# Altium project RoomClimateClock.PrjPcb
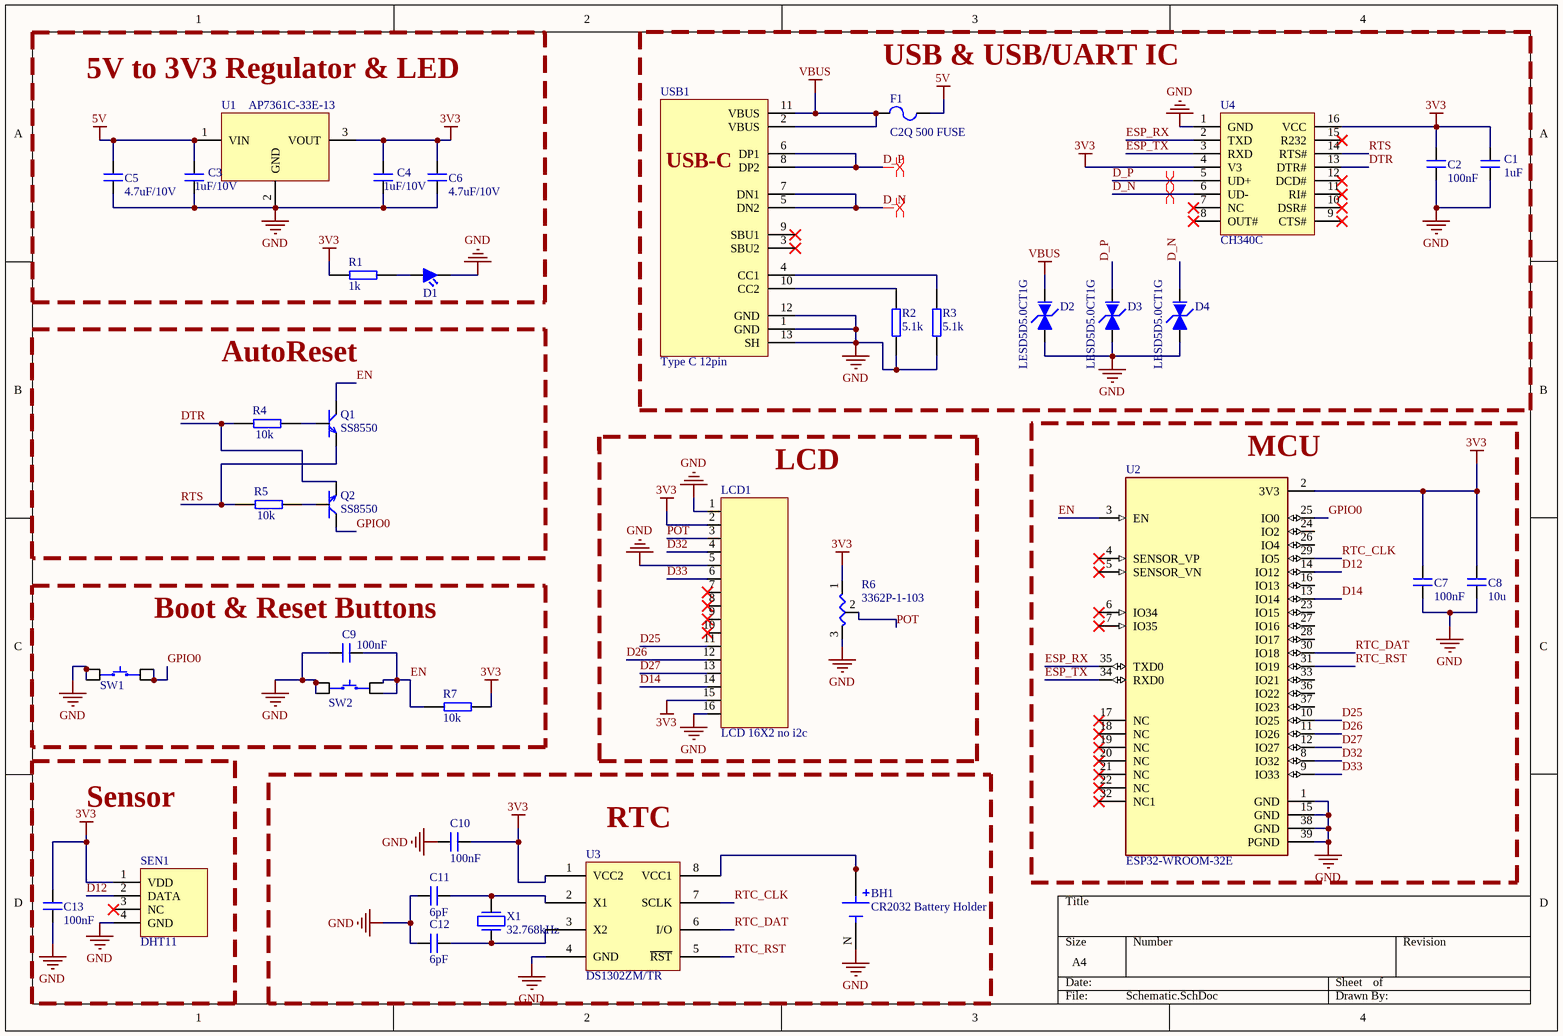
[diagram p0: Schematic.SchDoc]
1 sheet, 38 parts. Net scope: global (net labels, ports and power ports of the same name join across sheets).
Board file: PCB1.PcbDoc

## Sheet Schematic.SchDoc
size A4; SheetNumber: 1; SheetTotal: 1

### Parts
BH1  CR2032 Battery Holder  [3035 battery holder CR2032]
C1  1uF  [0603 CAP]
C2  100nF  [0402 CAP]
C3  1uF/10V  [0603 CAP]
C4  1uF/10V  [0603 CAP]
C5  4.7uF/10V  [0402 CAP]
C6  4.7uF/10V  [0402 CAP]
C7  100nF  [0402 CAP]
C8  10u  [0805 CAP]
C9  100nF  [0402 CAP]
C10  100nF  [0402 CAP]
C11  6pF  [0402 CAP]
C12  6pF  [0402 CAP]
C13  100nF  [0402 CAP]
D1  LED RED 0805  [LED 0805]  (value not drawn)
D2  LESD5D5.0CT1G  [SC-79/SOD-523]
D3  LESD5D5.0CT1G  [SC-79/SOD-523]
D4  LESD5D5.0CT1G  [SC-79/SOD-523]
F1  C2Q 500 FUSE  [C2Q 500 0603]
LCD1  LCD 16X2 no i2c  [LCD 16X2 NO I2C]
Q1  SS8550  [SOT23]
Q2  SS8550  [SOT23]
R1  1k  [0402 RES]
R2  5.1k  [0402 RES]
R3  5.1k  [0402 RES]
R4  10k  [0402 RES]
R5  10k  [0402 RES]
R6  3362P-1-103  [3362P-1-103]
R7  10k  [0402 RES]
SEN1  DHT11  [DHT11]
SW1  SWITCH TACTILE  [4 pin tactile switch]  (value not drawn)
SW2  SWITCH TACTILE  [4 pin tactile switch]  (value not drawn)
U1  AP7361C-33E-13  [SOT223]
U2  ESP32-WROOM-32E  [ESP32-WROOM-32E]
U3  DS1302ZM/TR  [SOP-8]
U4  CH340C  [SOP-16]
USB1  Type C 12pin  [TYPE-C 16PIN 2MD(073)]
X1  32.768kHz  [SMD3215-2P]

### Blocks framed on the sheet
5V to 3V3 Regulator & LED: C3-C6 D1 R1 U1
USB & USB/UART IC: C1 C2 D2-D4 F1 R2 R3 U4 USB1
AutoReset: Q1 Q2 R4 R5
MCU: C7 C8 U2
Boot & Reset Buttons: C9 R7 SW1 SW2
Sensor: C13 SEN1
RTC: BH1 C10-C12 U3 X1

### Nets
3V3: C1.2 C2.2 C4.2 C6.2 C7.2 C8.2 C10.2 C13.2 LCD1.2 LCD1.15 R1.1 R6.1 R7.1 SEN1.1(VDD) U1.3(VOUT) U2.2(3V3) U3.1(VCC2) U4.4(V3) U4.16(VCC)
5V: C3.2 C5.2 F1.2 U1.1(VIN)
GND: BH1.N(NEG) C1.1 C2.1 C3.1 C4.1 C5.1 C6.1 C7.1 C8.1 C9.1 C10.1 C11.2 C12.2 C13.1 D1.1 D2.2 D3.2 D4.2 LCD1.1 LCD1.5 LCD1.16 R2.1 R3.1 R6.3 SEN1.4(GND) SW1.1 SW1.3 SW2.1 SW2.3 U1.2(GND) U2.1(GND) U2.15(GND) U2.38(GND) U2.39(PGND) U3.4(GND) U4.1(GND) USB1.1(GND) USB1.12(GND) USB1.13(SH)
VBUS: D2.1 F1.1 USB1.2(VBUS) USB1.11(VBUS)
D12: SEN1.2(DATA) U2.14(IO12)
D14: LCD1.14 U2.13(IO14)
D25: LCD1.11 U2.10(IO25)
D26: LCD1.12 U2.11(IO26)
D27: LCD1.13 U2.12(IO27)
D32: LCD1.4 U2.8(IO32)
D33: LCD1.6 U2.9(IO33)
D_N: D4.1 U4.6(UD-) USB1.5(DN2) USB1.7(DN1)
D_P: D3.1 U4.5(UD+) USB1.6(DP1) USB1.8(DP2)
DTR: Q2.2(E) R4.1 U4.13(DTR#)
EN: C9.2 Q1.3(C) R7.2 SW2.2 SW2.4 U2.3(EN)
ESP_RX: U2.35(TXD0) U4.2(TXD)
ESP_TX: U2.34(RXD0) U4.3(RXD)
GPIO0: Q2.3(C) SW1.2 SW1.4 U2.25(IO0)
POT: LCD1.3 R6.2
RTC_CLK: U2.29(IO5) U3.7(SCLK)
RTC_DAT: U2.30(IO18) U3.6(I/O)
RTC_RST: U2.31(IO19) U3.5(~{RST})
RTS: Q1.2(E) R5.1 U4.14(RTS#)
NetBH1_P: BH1.P(POS) U3.8(VCC1)
NetC11_1: C11.1 U3.2(X1) X1.2
NetC12_1: C12.1 U3.3(X2) X1.1
NetD1_2: D1.2 R1.2
NetQ1_1: Q1.1(B) R4.2
NetQ2_1: Q2.1(B) R5.2
NetR2_2: R2.2 USB1.10(CC2)
NetR3_2: R3.2 USB1.4(CC1)

Not connected (* = marked no-connect by the designer): LCD1 7* 8* 9* 10*; SEN1 3(NC)*; U2 4(SENSOR_VP)* 5(SENSOR_VN)* 6(IO34)* 7(IO35)* 16(IO13) 17(NC)* 18(NC)* 19(NC)* 20(NC)* 21(NC)* 22(NC)* 23(IO15) 24(IO2) 26(IO4) 27(IO16) 28(IO17) 32(NC1)* 33(IO21) 36(IO22) 37(IO23); U4 7(NC)* 8(OUT#)* 9(CTS#)* 10(DSR#)* 11(RI#)* 12(DCD#)* 15(R232)*; USB1 3(SBU2)* 9(SBU1)*

### Layout directives
differential pair: D_N, D_P

### Notes on the sheet
- LCD
- (in symbol USB TYPE C 12 PIN (Right Angle)) USB-C

### Library data of the parts
BH1 = CR2032 Battery Holder: Holder Battery; Coin Battery; 1 Cell; PC Pin; 0.787 in. Dia.; Manufacturer: Keystone Electronics; Manufacturer Part Number: 3035; Supplier: Digikey; Supplier Part Number: 36-3035-ND; RoHS: Yes; Category: Batteries and Accessories; Stock: 76867; Pricing: 1=0,32, 25=0,2912, 100=0,2209, 250=0,19516, 500=0,1522, 1000=0,13912 (USD); ComponentLink1URL: http://www.keyelco.com/product-pdf.cfm?p=14185&src-supplier=Digikey; ComponentLink1Description: http://www.keyelco.com/product-pdf.cfm?p=14185&src-supplier=Digikey; ComponentLink2URL: https://datasheet.octopart.com/3035-Keystone-datasheet-137320232.pdf?src-supplier=TME; ComponentLink2Description: https://datasheet.octopart.com/3035-Keystone-datasheet-137320232.pdf?src-supplier=TME
C1 = 0603 1u CAP: Ceramic Capacitor, Multilayer, Ceramic, 25V, 10% +Tol, 10% -Tol, X7R, 15% TC, 1uF, Surface Mount, 0603; Manufacturer: Murata; Manufacturer Part Number: GCM188R71E105KA64D; Multilayer: Yes; Reference Standard: AEC-Q200; Case: 0603; Supplier: Digikey; Supplier Part Number: 490-10673-6-ND; RoHS: Yes; Category: Ceramic Capacitors; Stock: 2612025; Pricing: 1=0,24, 10=0,158, 50=0,1, 100=0,08, 500=0,05776, 1000=0,0511 (USD); Mounting Technology: Surface Mount; Pins: 2; Dielectric Material: Ceramic; Package Shape: Rectangular; Case/Package: 0603; Terminal Finish: Nickel; Min Operating Temperature: -55°C; Max Operating Temperature: 125°C; JESD-609 Code: e3; Value: 1uF; Capacitor Type: Ceramic; Tolerance  (fill in as +-): 10%; Package Style: SMTMeter; Packaging: Tape and Reel; Tolerance (fill in as +-): 10%; Rated DC Voltage (URdc): 25V; Temperature Characteristics Code: X7R; Termination: Wraparound; Length: 1.6mm; Width: 0.8mm; Height: 0.9mm; Reach SVHC Compliant: Yes; RoHS Compliant: Yes; ComponentLink1URL: https://datasheet.ciiva.com:443/pdfs/VipMasterIC/IC/MURE/MURE-S-A0004362469/MURE-S-A0004362812-1.pdf?src-supplier=IHS+Markit; ComponentLink1Description: https://datasheet.ciiva.com:443/pdfs/VipMasterIC/IC/MURE/MURE-S-A0004362469/MURE-S-A0004362812-1.pdf?src-supplier=IHS+Markit; ComponentLink2URL: https://datasheet.ciiva.com/11616/product-11616499.pdf?src-supplier=Avnet; ComponentLink2Description: https://datasheet.ciiva.com/11616/product-11616499.pdf?src-supplier=Avnet; ComponentLink3URL: https://datasheet.ciiva.com/26843/getdatasheetpartid-562446-26843671.pdf?src-supplier=Verical; ComponentLink3Description: https://datasheet.ciiva.com/26843/getdatasheetpartid-562446-26843671.pdf?src-supplier=Verical
C2 C7 C9 C10 C13 = 0402 100n AP: Ceramic Capacitor, Multilayer, Ceramic, 25V, 10% +Tol, 10% -Tol, X7R, 15% TC, 0.1uF, Surface Mount, 0402; Manufacturer: Murata; Manufacturer Part Number: GRM155R71E104KE14J; Multilayer: Yes; Case: 0402; Supplier: Digikey; Supplier Part Number: 490-14603-1-ND; RoHS: Yes; Category: Ceramic Capacitors; Stock: 3911559; Pricing: 1=0,1, 10=0,024, 50=0,0136, 100=0,0105, 500=0,00794, 1000=0,00623, 2500=0,00566, 5000=0,00521 (USD); Mounting Technology: Surface Mount; Pins: 2; Dielectric Material: Ceramic; Package Shape: Rectangular; Case/Package: 0402; Terminal Finish: Nickel; Min Operating Temperature: -55°C; Max Operating Temperature: 125°C; JESD-609 Code: e3; Value: 100nF; Capacitor Type: Ceramic; Tolerance  (fill in as +-): 10%; Package Style: SMTMeter; Packaging: Tape and Reel; Tolerance (fill in as +-): 10%; Rated DC Voltage (URdc): 25V; Temperature Characteristics Code: X7R; Termination: Wraparound; Length: 1mm; Width: 0.5mm; Height: 0.5mm; Reach SVHC Compliant: Yes; RoHS Compliant: Yes; ComponentLink1URL: https://datasheet.ciiva.com:443/pdfs/VipMasterIC/IC/MURE/MURE-S-A0004362469/MURE-S-A0004364872-1.pdf?src-supplier=IHS+Markit; ComponentLink1Description: https://datasheet.ciiva.com:443/pdfs/VipMasterIC/IC/MURE/MURE-S-A0004362469/MURE-S-A0004364872-1.pdf?src-supplier=IHS+Markit; ComponentLink2URL: http://www.mouser.com/ds/2/281/c02e-2905.pdf?src-supplier=Mouser; ComponentLink2Description: http://www.mouser.com/ds/2/281/c02e-2905.pdf?src-supplier=Mouser; ComponentLink3URL: https://datasheet.octopart.com/GRM155R71E104KE14J-Murata-datasheet-155345056.pdf?src-supplier=Element14; ComponentLink3Description: https://datasheet.octopart.com/GRM155R71E104KE14J-Murata-datasheet-155345056.pdf?src-supplier=Element14; ComponentLink4URL: http://search.murata.co.jp/Ceramy/image/img/A01X/G101/ENG/GRM155R71E104KE14-01.pdf?src-supplier=Digikey; ComponentLink4Description: http://search.murata.co.jp/Ceramy/image/img/A01X/G101/ENG/GRM155R71E104KE14-01.pdf?src-supplier=Digikey; ComponentLink5URL: https://datasheet.octopart.com/GRM155R71E104KE14J-Murata-datasheet-165579666.pdf?src-supplier=TME; ComponentLink5Description: https://datasheet.octopart.com/GRM155R71E104KE14J-Murata-datasheet-165579666.pdf?src-supplier=TME
C3 C4 = 0603 1u CAP: MURATA GRM155R61A475MEAAD; Manufacturer Part Number: GCM188R71E105KA64D; Dielectric Material: Ceramic; Value: 1uF; Multilayer: Yes; Tolerance  (fill in as +-): 10%; Rated DC Voltage (URdc): 25V; Temperature Characteristics Code: X7R; Reference Standard: AEC-Q200; Case: 0603; Supplier: Digikey; Supplier Part Number: 490-10673-6-ND; Manufacturer: Murata; RoHS: Yes; Category: Ceramic Capacitors; Stock: 2612025; Pricing: 1=0,24, 10=0,158, 50=0,1, 100=0,08, 500=0,05776, 1000=0,0511 (USD); Mounting Technology: Surface Mount; Pins: 2; Package Shape: Rectangular; Case/Package: 0603; Terminal Finish: Nickel; Min Operating Temperature: -55°C; Max Operating Temperature: 125°C; JESD-609 Code: e3; Capacitor Type: Ceramic; Package Style: SMTMeter; Packaging: Tape and Reel; Tolerance (fill in as +-): 10%; Termination: Wraparound; Length: 1.6mm; Width: 0.8mm; Height: 0.9mm; Reach SVHC Compliant: Yes; RoHS Compliant: Yes; ComponentLink1URL: https://datasheet.ciiva.com:443/pdfs/VipMasterIC/IC/MURE/MURE-S-A0004362469/MURE-S-A0004362812-1.pdf?src-supplier=IHS+Markit; ComponentLink1Description: https://datasheet.ciiva.com:443/pdfs/VipMasterIC/IC/MURE/MURE-S-A0004362469/MURE-S-A0004362812-1.pdf?src-supplier=IHS+Markit; ComponentLink2URL: https://datasheet.ciiva.com/11616/product-11616499.pdf?src-supplier=Avnet; ComponentLink2Description: https://datasheet.ciiva.com/11616/product-11616499.pdf?src-supplier=Avnet; ComponentLink3URL: https://datasheet.ciiva.com/26843/getdatasheetpartid-562446-26843671.pdf?src-supplier=Verical; ComponentLink3Description: https://datasheet.ciiva.com/26843/getdatasheetpartid-562446-26843671.pdf?src-supplier=Verical
C5 C6 = 0402 CAP: MURATA GRM155R61A475MEAAD; Case: 0402
C8 = 0805 10u CAP: Case: 0805
C11 C12 = 0402 CAP: GRM1555C1H6R0DA01D / CAP CER 6PF 50V C0G/NP0 0402; Case: 0402
D2-D4 = LESD5D5.0CT1G: TVS Diode
F1 = C2Q 500 FUSE: Fuse Chip Very Fast Acting 0.5A 32V SMD Solder Pad 0603 Ceramic CE/UL; Manufacturer: Bel; Manufacturer Part Number: C2Q500; Fuse Current: 500mA; Value: 290mR; Supplier: Digikey; Supplier Part Number: 507-1089-1-ND; RoHS: Yes; Stock: 507621; Pricing: 1=0,23, 5=0,22, 10=0,211, 50=0,1884, 100=0,1754, 250=0,15592, 500=0,12992, 1000=0,12343 (USD); ComponentLink1URL: https://datasheet.ciiva.com/8264/c2q-8264055.pdf?src-supplier=Avnet; ComponentLink1Description: https://datasheet.ciiva.com/8264/c2q-8264055.pdf?src-supplier=Avnet; ComponentLink2URL: https://datasheet.ciiva.com/300/c2q-300617.pdf?src-supplier=Digikey; ComponentLink2Description: https://datasheet.ciiva.com/300/c2q-300617.pdf?src-supplier=Digikey; ComponentLink3URL: https://datasheet.ciiva.com/300/c2q-300618.pdf?src-supplier=Digikey; ComponentLink3Description: https://datasheet.ciiva.com/300/c2q-300618.pdf?src-supplier=Digikey; ComponentLink4URL: https://datasheet.ciiva.com/300/c2q-300619.pdf?src-supplier=Digikey; ComponentLink4Description: https://datasheet.ciiva.com/300/c2q-300619.pdf?src-supplier=Digikey
Q1 Q2 = SS8550: Bjt Transistor NPN 25V 1.5A 300MW 3-PIN SOT-23 T/r; Manufacturer: Comchip; Manufacturer Part Number: SS8050-G; Transition Frequency: 100MHz; Collector-emitter Voltage-Max: 400mV; Collector Base Voltage (VCBO): 40V; Collector Emitter Saturation Voltage: 500mV; Emitter Base Voltage (VEBO): 5V; hFE Min: 200NUMBER; Number of Elements: 1NUMBER; Supplier: Mouser; Supplier Part Number: 750-SS8050-G; RoHS: Yes; Category: Transistors; Stock: 3417; Pricing: 1=0,29, 10=0,2, 50=0,2, 100=0,082, 1000=0,057, 10000=0,037 (USD); Mounting Technology: Surface Mount; Case/Package: TO-236-3; Max Operating Temperature: 150°C; Packaging: Cut Tape; Max Collector Current: 1.5A; Max Power Dissipation: 300mW; Collector Emitter Breakdown Voltage: 25V; Max Breakdown Voltage: 25V; Series: -; Power Dissipation: 300mW; Height: 1.15mm; RoHS Compliant: Yes; ComponentLink1URL: http://www.comchiptech.com/admin/files/product/SS8050-G RevA181526.pdf?src-supplier=Digikey; ComponentLink1Description: http://www.comchiptech.com/admin/files/product/SS8050-G RevA181526.pdf?src-supplier=Digikey; JLCPCB Part: C2150
R1 = 0402 1k RES: Fixed Resistor, Metal Glaze/thick Film, 0.06W, 10000ohm, 50V, 1% +/-Tol, 100ppm/Cel, Surface Mount, 0402; Manufacturer: Samsung; Manufacturer Part Number: RC1005F103CS; Power: 60mW; Value: 1kR; Temperature Coefficient: 100ppm/°C; Package Height: 0.35mm; Package Length: 1mm; Package Width: 0.5mm; Case: 0402; Supplier: Digikey; Supplier Part Number: 1276-3431-1-ND; RoHS: Yes; Category: Chip SMD Resistors; Stock: 45634757; Pricing: 1=0,1, 10=0,024, 50=0,0156, 100=0,0132, 500=0,00922, 1000=0,00803, 5000=0,00598 (USD); Mounting Technology: Surface Mount; Pins: 2; Package Shape: Rectangular; Case/Package: 0402; Terminal Finish: Nickel; Min Operating Temperature: -55°C; Max Operating Temperature: 125°C; Tolerance: 1%; JESD-609 Code: e3; Resistor Type: FIXED RESISTOR; Construction: Chip; Package Style: SMTMeter; Packaging: Tape and Reel; Technology: METAL GLAZE/THICK FILM; Working Voltage: 50V; Reach SVHC Compliant: Yes; RoHS Compliant: Yes; ComponentLink1URL: https://datasheet.ciiva.com:443/pdfs/VipMasterIC/IC/SEMS/SEMS-S-A0001326806/SEMS-S-A0001326806-1.pdf?src-supplier=IHS+Markit; ComponentLink1Description: https://datasheet.ciiva.com:443/pdfs/VipMasterIC/IC/SEMS/SEMS-S-A0001326806/SEMS-S-A0001326806-1.pdf?src-supplier=IHS+Markit; ComponentLink2URL: https://datasheet.ciiva.com/15196/getdatasheetpartid-504789-15196214.pdf?src-supplier=Verical; ComponentLink2Description: https://datasheet.ciiva.com/15196/getdatasheetpartid-504789-15196214.pdf?src-supplier=Verical; ComponentLink3URL: https://datasheet.ciiva.com/16481/rcseries-16481007.pdf?src-supplier=Future+Electronics; ComponentLink3Description: https://datasheet.ciiva.com/16481/rcseries-16481007.pdf?src-supplier=Future+Electronics
R2 R3 = 0402 RES: Case: 0402
R4 R5 R7 = 0402 10k RES: Fixed Resistor, Metal Glaze/thick Film, 0.06W, 10000ohm, 50V, 1% +/-Tol, 100ppm/Cel, Surface Mount, 0402; Manufacturer: Samsung; Manufacturer Part Number: RC1005F103CS; Power: 60mW; Value: 10kR; Temperature Coefficient: 100ppm/°C; Package Height: 0.35mm; Package Length: 1mm; Package Width: 0.5mm; Case: 0402; Supplier: Digikey; Supplier Part Number: 1276-3431-1-ND; RoHS: Yes; Category: Chip SMD Resistors; Stock: 45634757; Pricing: 1=0,1, 10=0,024, 50=0,0156, 100=0,0132, 500=0,00922, 1000=0,00803, 5000=0,00598 (USD); Mounting Technology: Surface Mount; Pins: 2; Package Shape: Rectangular; Case/Package: 0402; Terminal Finish: Nickel; Min Operating Temperature: -55°C; Max Operating Temperature: 125°C; Tolerance: 1%; JESD-609 Code: e3; Resistor Type: FIXED RESISTOR; Construction: Chip; Package Style: SMTMeter; Packaging: Tape and Reel; Technology: METAL GLAZE/THICK FILM; Working Voltage: 50V; Reach SVHC Compliant: Yes; RoHS Compliant: Yes; ComponentLink1URL: https://datasheet.ciiva.com:443/pdfs/VipMasterIC/IC/SEMS/SEMS-S-A0001326806/SEMS-S-A0001326806-1.pdf?src-supplier=IHS+Markit; ComponentLink1Description: https://datasheet.ciiva.com:443/pdfs/VipMasterIC/IC/SEMS/SEMS-S-A0001326806/SEMS-S-A0001326806-1.pdf?src-supplier=IHS+Markit; ComponentLink2URL: https://datasheet.ciiva.com/15196/getdatasheetpartid-504789-15196214.pdf?src-supplier=Verical; ComponentLink2Description: https://datasheet.ciiva.com/15196/getdatasheetpartid-504789-15196214.pdf?src-supplier=Verical; ComponentLink3URL: https://datasheet.ciiva.com/16481/rcseries-16481007.pdf?src-supplier=Future+Electronics; ComponentLink3Description: https://datasheet.ciiva.com/16481/rcseries-16481007.pdf?src-supplier=Future+Electronics
R6 = 3362P-1-103: Trimmer, Cermet, 0.5W, 10000ohm, 10% +/-Tol, -100,100ppm/Cel, 2628; Manufacturer: Bourns; Manufacturer Part Number: 3362P-1-103RLF; Power: 500mW; Value: 10kR; Rotational Angle: 240°; Temperature Coefficient: -100100ppm/°C; Package Length: 6.6mm; Package Height: 4.7mm; Package Width: 7mm; Supplier: Mouser; Supplier Part Number: 652-3362P-1-103RLF; RoHS: Yes; Category: Variable Resistors and Potentiometers; Stock: 1232; Pricing: 1=1,83, 10=1,39, 50=1,39, 100=1,28, 1000=0,861, 10000=0,833 (USD); Terminal Finish: Tin; Case/Package: 2628; Min Operating Temperature: -55°C; Max Operating Temperature: 125°C; Tolerance: 10%; JESD-609 Code: e3; Resistor Type: TRIMMER; Construction: Trimmer Pot; Package Style: PCB MountMeter; Packaging: Tape and Reel; Technology: CERMET; Reach SVHC Compliant: Yes; RoHS Compliant: Yes; ComponentLink1URL: https://datasheet.ciiva.com:443/pdfs/VipMasterIC/IC/BOUR/BOUR-S-A0008793914/BOUR-S-A0008793914-1.pdf?src-supplier=IHS+Markit; ComponentLink1Description: https://datasheet.ciiva.com:443/pdfs/VipMasterIC/IC/BOUR/BOUR-S-A0008793914/BOUR-S-A0008793914-1.pdf?src-supplier=IHS+Markit; ComponentLink2URL: https://datasheet.ciiva.com/8701/3362-8701790.pdf?src-supplier=Avnet; ComponentLink2Description: https://datasheet.ciiva.com/8701/3362-8701790.pdf?src-supplier=Avnet; ComponentLink3URL: https://datasheet.ciiva.com/2160/3362-2160816.pdf?src-supplier=Digikey; ComponentLink3Description: https://datasheet.ciiva.com/2160/3362-2160816.pdf?src-supplier=Digikey; ComponentLink4URL: https://datasheet.ciiva.com/15211/getdatasheetpartid-343160-15211788.pdf?src-supplier=Verical; ComponentLink4Description: https://datasheet.ciiva.com/15211/getdatasheetpartid-343160-15211788.pdf?src-supplier=Verical
SEN1 = DHT11: Temperature and Humidity Sensor; Voltage: 3 to 5; Max Operating Current: 2.5mA; Humidity Range: 20-80% / ±5%; Sampling Rate: 1 Hz; Temperature Range: 0-50°C / ±2°C
SW1 SW2 = SWITCH TACTILE: TL3305BF260QG Keypad Switch, 1 Switches, SPST, Momentary, 0.05A, 12VDC, 3.04N, Solder Terminal, Surface Mount-straight; Manufacturer: E-Switch; Circuit Configuration: 1X1; Contact Current(DC)-Max: 50mA; Contact DC Max Rating R Load: .05A@12VDC; Contact Voltage(DC)-Max: 12V; Electrical Life: 200000Cycles; Number of Switches: 1; Body Breadth: 4.5inch; Body Height: 4.9mm; Body Length or Diameter: 4.5mm; Supplier: Digikey; Supplier Part Number: EG5354CT-ND; Manufacturer Part Number: TL3305BF260QG; RoHS: Yes; Category: Tactile Switches; Stock: 306451; Pricing: 1=0,22, 10=0,214, 25=0,2028, 100=0,1836, 250=0,16736, 500=0,15558 (USD); Mounting Technology: Surface Mount; Min Operating Temperature: -20°C; Max Operating Temperature: 70°C; Operating Force-Max: 3.04N; Packaging: Tape and Reel; Switch Action: MOMENTARY; Switch Function: SPST; Switch Type: Keypad; Termination: Solder; Reach SVHC Compliant: Yes; RoHS Compliant: Yes; ComponentLink1URL: https://datasheet.ciiva.com:443/pdfs/VipMasterIC/IC/ESCH/ESCH-S-A0003149373/ESCH-S-A0003149373-1.pdf?src-supplier=IHS+Markit; ComponentLink1Description: https://datasheet.ciiva.com:443/pdfs/VipMasterIC/IC/ESCH/ESCH-S-A0003149373/ESCH-S-A0003149373-1.pdf?src-supplier=IHS+Markit; ComponentLink2URL: http://www.farnell.com/datasheets/2554191.pdf?src-supplier=Farnell; ComponentLink2Description: http://www.farnell.com/datasheets/2554191.pdf?src-supplier=Farnell; ComponentLink3URL: https://sten-eswitch-13110800-production.s3.amazonaws.com/system/asset/product_line/data_sheet/213/TL3305.pdf?src-supplier=Digikey; ComponentLink3Description: https://sten-eswitch-13110800-production.s3.amazonaws.com/system/asset/product_line/data_sheet/213/TL3305.pdf?src-supplier=Digikey; ComponentLink4URL: http://spec_sheets.e-switch.com/specs/P010472.pdf?src-supplier=Digikey; ComponentLink4Description: http://spec_sheets.e-switch.com/specs/P010472.pdf?src-supplier=Digikey; ComponentLink5URL: https://datasheet.octopart.com/TL3305BF260QG-E-Switch-datasheet-100437264.pdf?src-supplier=Element14; ComponentLink5Description: https://datasheet.octopart.com/TL3305BF260QG-E-Switch-datasheet-100437264.pdf?src-supplier=Element14; ComponentLink6URL: https://datasheet.octopart.com/TL3305BF260QG-E-Switch-datasheet-62330036.pdf?src-supplier=Future+Electronics; ComponentLink6Description: https://datasheet.octopart.com/TL3305BF260QG-E-Switch-datasheet-62330036.pdf?src-supplier=Future+Electronics; ComponentLink7URL: http://www.farnell.com/datasheets/2554191.pdf?src-supplier=Newark; ComponentLink7Description: http://www.farnell.com/datasheets/2554191.pdf?src-supplier=Newark
U1 = AP7361C-33E-13: Fixed Positive LDO Regulator, 3.3V, 0.15V Dropout, SOT223; Manufacturer: Diodes; Package Body Material: Plastic; Dropout Voltage1-Max: 150mV; Max Supply Voltage: 6V; Min Input Voltage: 4.3V; Channels: 1; Output Current1-Max: 1A; Output Voltage1-Max: 3.333V; Output Voltage1-Min: 3.267V; Regulator Type: FIXED POSITIVE SINGLE OUTPUT LDO REGULATOR; Supplier: Mouser; Supplier Part Number: 621-AP7361C-33E-13; Manufacturer Part Number: AP7361C-33E-13; RoHS: Yes; Category: TVS Diodes; Stock: 15754; Pricing: 1=0,6, 10=0,482, 50=0,482, 100=0,358, 1000=0,234, 10000=0,17 (USD); Case/Package: SOT223; Pins: 3; Package Shape: Rectangular; Terminal Finish: Tin; JESD-609 Code: e3; JESD-30 Code: R-PDSO-G3; Operating Temperature, TJ-Max: 150°C; Operating Temperature, TJ-Min: -40°C; Output Voltage1-Nom: 3.3V; Package Style: SMALL OUTLINEMeter; Surface Mount: Yes; Terminal Form: Gull Wing; Terminal Position: DUAL; Length: 6.5mm; Width: 3.5mm; Height - Seated (Max): 1.8mm; Terminal Pitch: 2.3mm; Reach SVHC Compliant: Yes; RoHS Compliant: Yes; ComponentLink1URL: https://datasheet.ciiva.com:443/pdfs/VipMasterIC/IC/DIOD/DIOD-S-A0004145196/DIOD-S-A0004145196-1.pdf?src-supplier=IHS+Markit; ComponentLink1Description: https://datasheet.ciiva.com:443/pdfs/VipMasterIC/IC/DIOD/DIOD-S-A0004145196/DIOD-S-A0004145196-1.pdf?src-supplier=IHS+Markit; ComponentLink2URL: http://www.mouser.com/ds/2/115/AP7361C-775034.pdf?src-supplier=Mouser; ComponentLink2Description: http://www.mouser.com/ds/2/115/AP7361C-775034.pdf?src-supplier=Mouser; ComponentLink3URL: https://datasheet.octopart.com/AP7361C-33E-13-Diodes-Inc.-datasheet-101745716.pdf?src-supplier=Element14; ComponentLink3Description: https://datasheet.octopart.com/AP7361C-33E-13-Diodes-Inc.-datasheet-101745716.pdf?src-supplier=Element14; ComponentLink4URL: https://datasheet.octopart.com/AP7361C-33E-13-Diodes-Inc.-datasheet-101745716.pdf?src-supplier=Future+Electronics; ComponentLink4Description: https://datasheet.octopart.com/AP7361C-33E-13-Diodes-Inc.-datasheet-101745716.pdf?src-supplier=Future+Electronics; ComponentLink5URL: https://www.diodes.com/assets/Datasheets/AP7361C.pdf?src-supplier=Digikey; ComponentLink5Description: https://www.diodes.com/assets/Datasheets/AP7361C.pdf?src-supplier=Digikey; ComponentLink6URL: https://datasheet.octopart.com/AP7361C-33E-13-Diodes-Inc.-datasheet-158996477.pdf?src-supplier=SHENGYU+ELECTRONICS; ComponentLink6Description: https://datasheet.octopart.com/AP7361C-33E-13-Diodes-Inc.-datasheet-158996477.pdf?src-supplier=SHENGYU+ELECTRONICS
U3 = DS1302ZM/TR: RTC IC SOP-8 Real-Time Clocks(RTC) ROHS; Manufacturer: HGSEMI; Case/Package: SOP-8; ComponentLink1Description: datasheet; ComponentLink1URL: https://wmsc.lcsc.com/wmsc/upload/file/pdf/v2/lcsc/2404010908_HGSEMI-DS1302ZM-TR_C910859.pdf; JLCPCB Part: C910859
U4 = CH340C: USB to UART bridge IC / No Crystal needed; JLCPCB Part: C7464026; Case/Package: SOP-16
USB1 = USB TYPE C 12 PIN (Right Angle): Manufacturer SHOU HAN / MFR.Part #TYPE-C 16PIN 2MD(073) / JLCPCB Part # C2765186; Voltage Rating: 5V; Current Rating: 5A; Manufacturer: SHOU HAN; JLCPCB Part: C2765186
X1 = Q13FC13500049: 32.768kHz Surface mount crystal oscillator 6pF ±20ppm SMD3215-2P Crystals ROHS; Manufucter: Seiko Epson; JLCPCB Part: C95361; Case/Package: SMD3215; Load Capacitance: 6pF